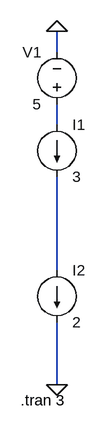
[diagram p0: schematic 1a.asc]
1a.asc, the LTspice schematic file:
Version 4.1
SHEET 1 880 680
WIRE 80 64 80 32
WIRE 80 176 80 144
WIRE 80 400 80 256
WIRE 80 576 80 480
FLAG 80 32 0
FLAG 80 576 0
SYMBOL voltage 80 160 R180
WINDOW 0 24 96 Left 2
WINDOW 3 24 16 Left 2
WINDOW 123 0 0 Left 0
WINDOW 39 0 0 Left 0
SYMATTR InstName V1
SYMATTR Value 5
SYMBOL current 80 176 R0
WINDOW 123 0 0 Left 0
WINDOW 39 0 0 Left 0
SYMATTR InstName I1
SYMATTR Value 3
SYMBOL current 80 400 R0
WINDOW 123 0 0 Left 0
WINDOW 39 0 0 Left 0
SYMATTR InstName I2
SYMATTR Value 2
TEXT 24 600 Left 2 !.tran 3

The netlist it stands for:
* 1a.asc
V1 N001 0 5
I1 N001 N002 3
I2 N002 0 2
.tran 3
.backanno
.end